# EAGLE design Register (EAGLE 7.3.0)
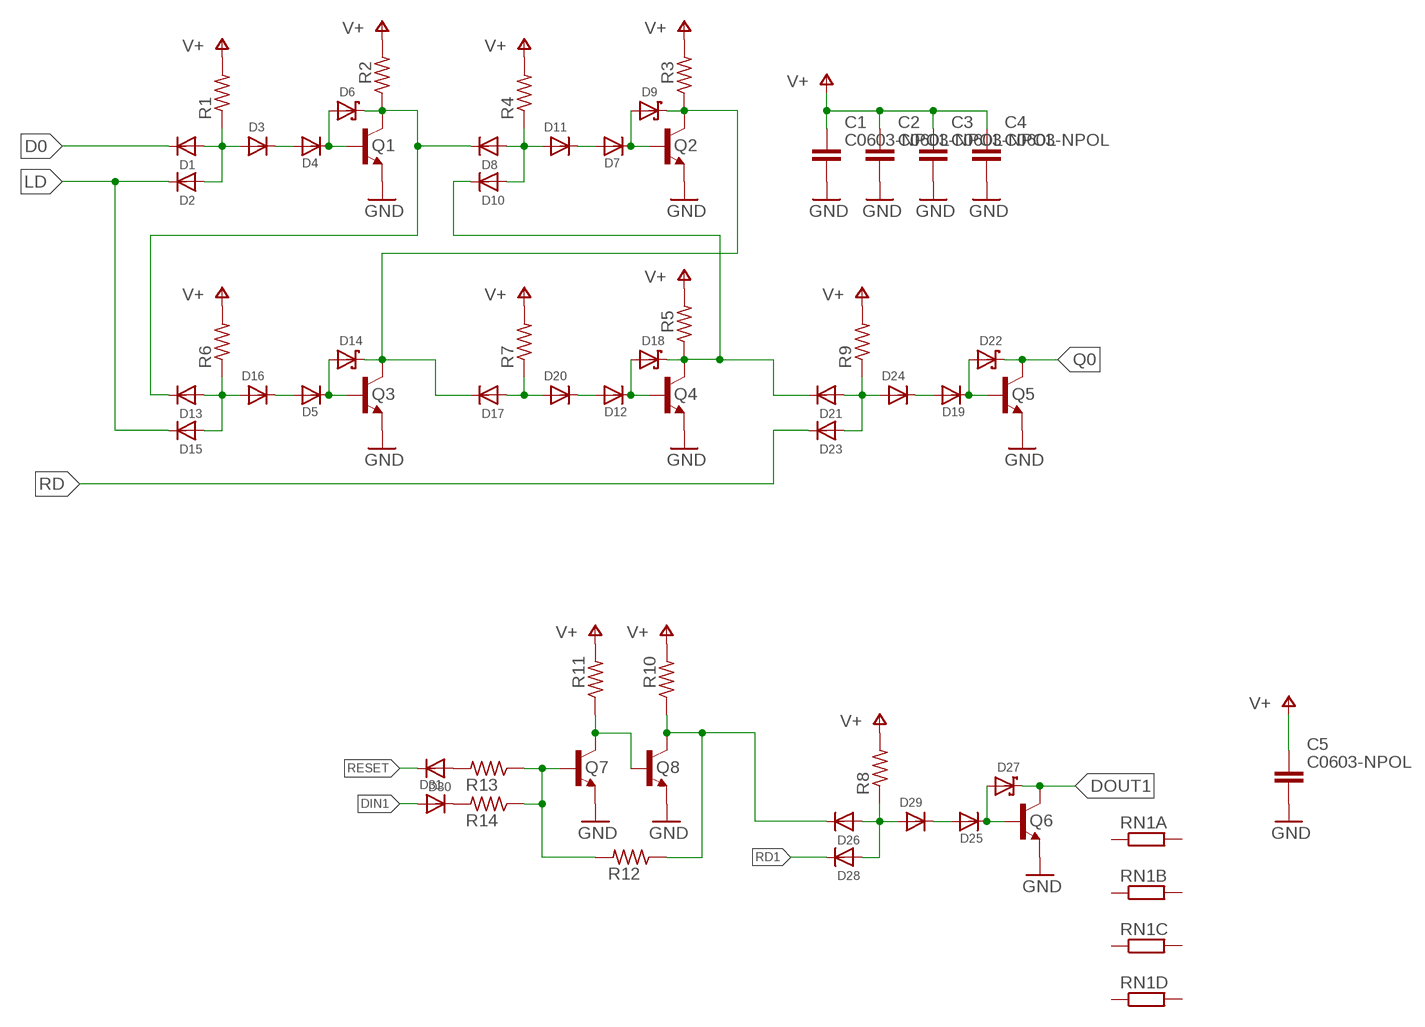
[diagram p0: schematic, sheet 1]

## Parts
C1  C0603-NPOL  [C0603]
C2  C0603-NPOL  [C0603]
C3  C0603-NPOL  [C0603]
C4  C0603-NPOL  [C0603]
C5  C0603-NPOL  [C0603]
D1  DIODE-SOD323  [SOD323F]
D2  DIODE-SOD323  [SOD323F]
D3  DIODE-SOD323  [SOD323F]
D4  DIODE-SOD323  [SOD323F]
D5  DIODE-SOD323  [SOD323F]
D6  SCHOTTKYSOT323  [SOT23]
D7  DIODE-SOD323  [SOD323F]
D8  DIODE-SOD323  [SOD323F]
D9  SCHOTTKYSOT323  [SOT23]
D10  DIODE-SOD323  [SOD323F]
D11  DIODE-SOD323  [SOD323F]
D12  DIODE-SOD323  [SOD323F]
D13  DIODE-SOD323  [SOD323F]
D14  SCHOTTKYSOT323  [SOT23]
D15  DIODE-SOD323  [SOD323F]
D16  DIODE-SOD323  [SOD323F]
D17  DIODE-SOD323  [SOD323F]
D18  SCHOTTKYSOT323  [SOT23]
D19  DIODE-SOD323  [SOD323F]
D20  DIODE-SOD323  [SOD323F]
D21  DIODE-SOD323  [SOD323F]
D22  SCHOTTKYSOT323  [SOT23]
D23  DIODE-SOD323  [SOD323F]
D24  DIODE-SOD323  [SOD323F]
D25  DIODE-SOD323  [SOD323F]
D26  DIODE-SOD323  [SOD323F]
D27  SCHOTTKYSOT323  [SOT23]
D28  DIODE-SOD323  [SOD323F]
D29  DIODE-SOD323  [SOD323F]
D30  DIODE-SOD323  [SOD323F]
D31  DIODE-SOD323  [SOD323F]
Q1  BC547-SOT23  [SOT23]
Q2  BC547-SOT23  [SOT23]
Q3  BC547-SOT23  [SOT23]
Q4  BC547-SOT23  [SOT23]
Q5  BC547-SOT23  [SOT23]
Q6  BC547-SOT23  [SOT23]
Q7  BC547-SOT23  [SOT23]
Q8  BC547-SOT23  [SOT23]
R1  470  R-0805  [R0805]
R2  150  R-0805  [R0805]
R3  150  R-0805  [R0805]
R4  470  R-0805  [R0805]
R5  150  R-0805  [R0805]
R6  470  R-0805  [R0805]
R7  470  R-0805  [R0805]
R8  470  R-0805  [R0805]
R9  470  R-0805  [R0805]
R10  150  R-0805  [R0805]
R11  150  R-0805  [R0805]
R12  150  R-0805  [R0805]
R13  150  R-0805  [R0805]
R14  150  R-0805  [R0805]
RN1  RESISTOR_ARRAY_4  [RN8P-4R-CRA06S]

## Nets
D0: D1.C
DIN1: D31.A
DOUT1: D27.3(C) Q6.3(C)
GND: C1.2 C2.2 C3.2 C4.2 C5.2 Q1.2(E) Q2.2(E) Q3.2(E) Q4.2(E) Q5.2(E) Q6.2(E) Q7.2(E) Q8.2(E)
LD: D2.C D15.C
N$1: D1.A D2.A D3.A R1.1
N$2: D3.C D4.A
N$3: D4.C D6.1(A) Q1.1(B)
N$4: D13.A D15.A D16.A R6.1
N$5: D8.A D10.A D11.A R4.1
N$6: D5.A D16.C
N$7: D7.A D11.C
N$8: D5.C D14.1(A) Q3.1(B)
N$9: D7.C D9.1(A) Q2.1(B)
N$10: D17.A D20.A R7.1
N$11: D12.A D20.C
N$12: D12.C D18.1(A) Q4.1(B)
N$13: D21.A D23.A D24.A R9.1
N$14: D19.A D24.C
N$15: D19.C D22.1(A) Q5.1(B)
N$16: D26.C Q8.3(C) R10.1 R12.1
N$17: D26.A D28.A D29.A R8.1
N$18: D25.A D29.C
N$19: D25.C D27.1(A) Q6.1(B)
N$20: Q7.3(C) Q8.1(B) R11.1
N$23: Q7.1(B) R12.2 R13.1 R14.1
N$25: D30.A R13.2
N$26: D31.C R14.2
N$77: D10.C D18.3(C) D21.C Q4.3(C) R5.1
N$88: D9.3(C) D14.3(C) D17.C Q2.3(C) Q3.3(C) R3.1
N$99: D6.3(C) D8.C D13.C Q1.3(C) R2.1
Q0: D22.3(C) Q5.3(C)
RD: D23.C
RD1: D28.C
RESET: D30.C
V+: C1.1 C2.1 C3.1 C4.1 C5.1 R1.2 R2.2 R3.2 R4.2 R5.2 R6.2 R7.2 R8.2 R9.2 R10.2 R11.2
Unconnected: RN1.1 RN1.2 RN1.3 RN1.4 RN1.5 RN1.6 RN1.7 RN1.8

## Library data of the parts
C1-C5 = SmallRoomLabs_Discrete:C0603
D1-D5 D7 D8 D10-D13 D15-D17 D19-D21 D23-D26 D28-D31 = SmallRoomLabs_Semiconductor:DIODE
D6 D9 D14 D18 D22 D27 = SmallRoomLabs_Semiconductor:SCHOTTKY
Q1-Q8 = SmallRoomLabs_Semiconductor:BC547
R1-R14 = SmallRoomLabs_Discrete:R
RN1 = dp_devices:RESISTOR_ARRAY_4: 4 Resistor Array 0603

## Board
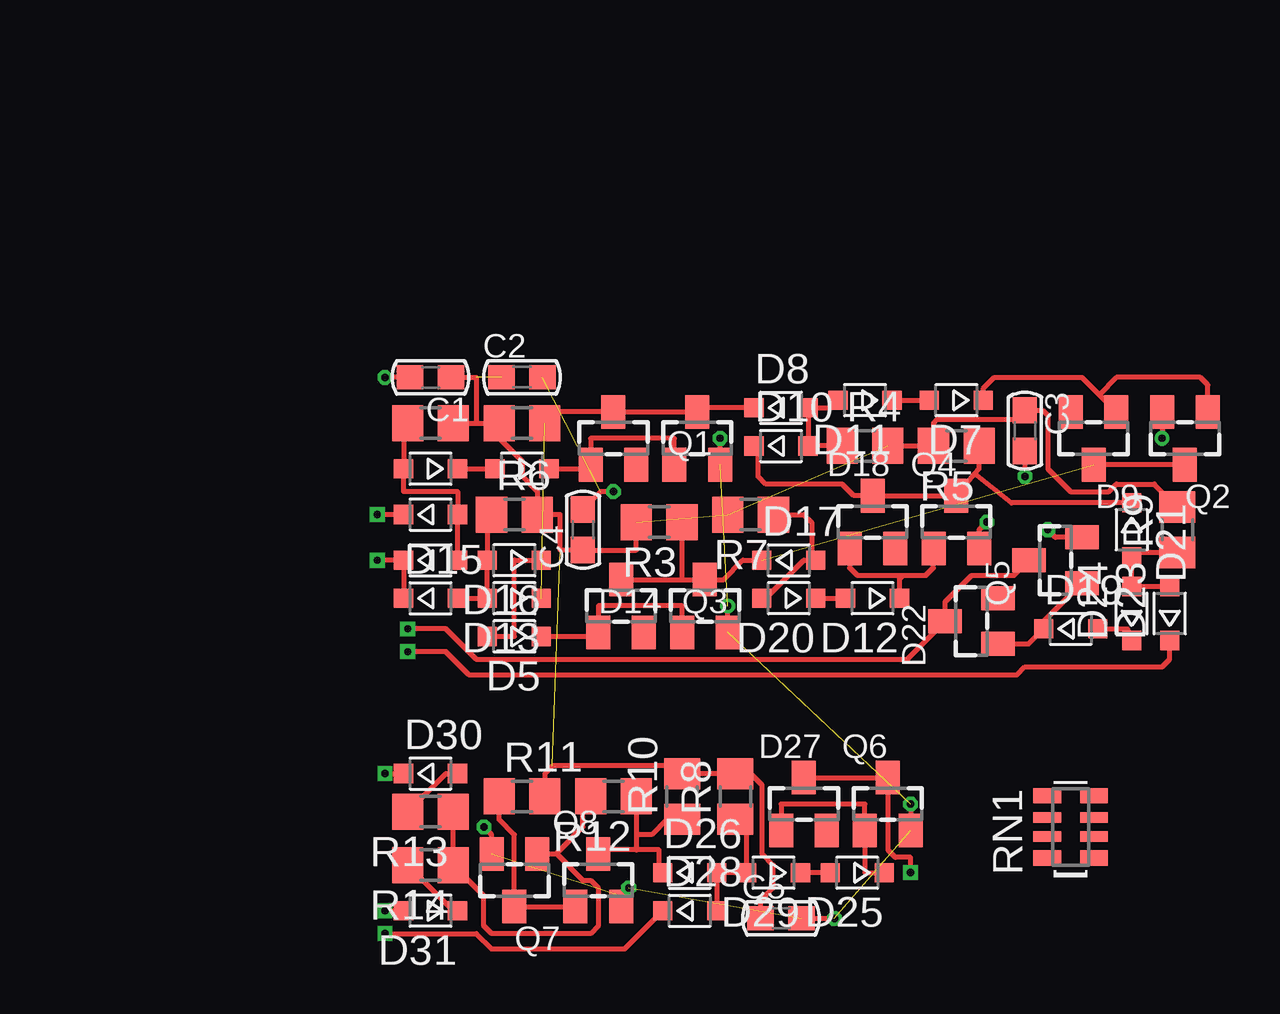
[diagram p1: board, top side]
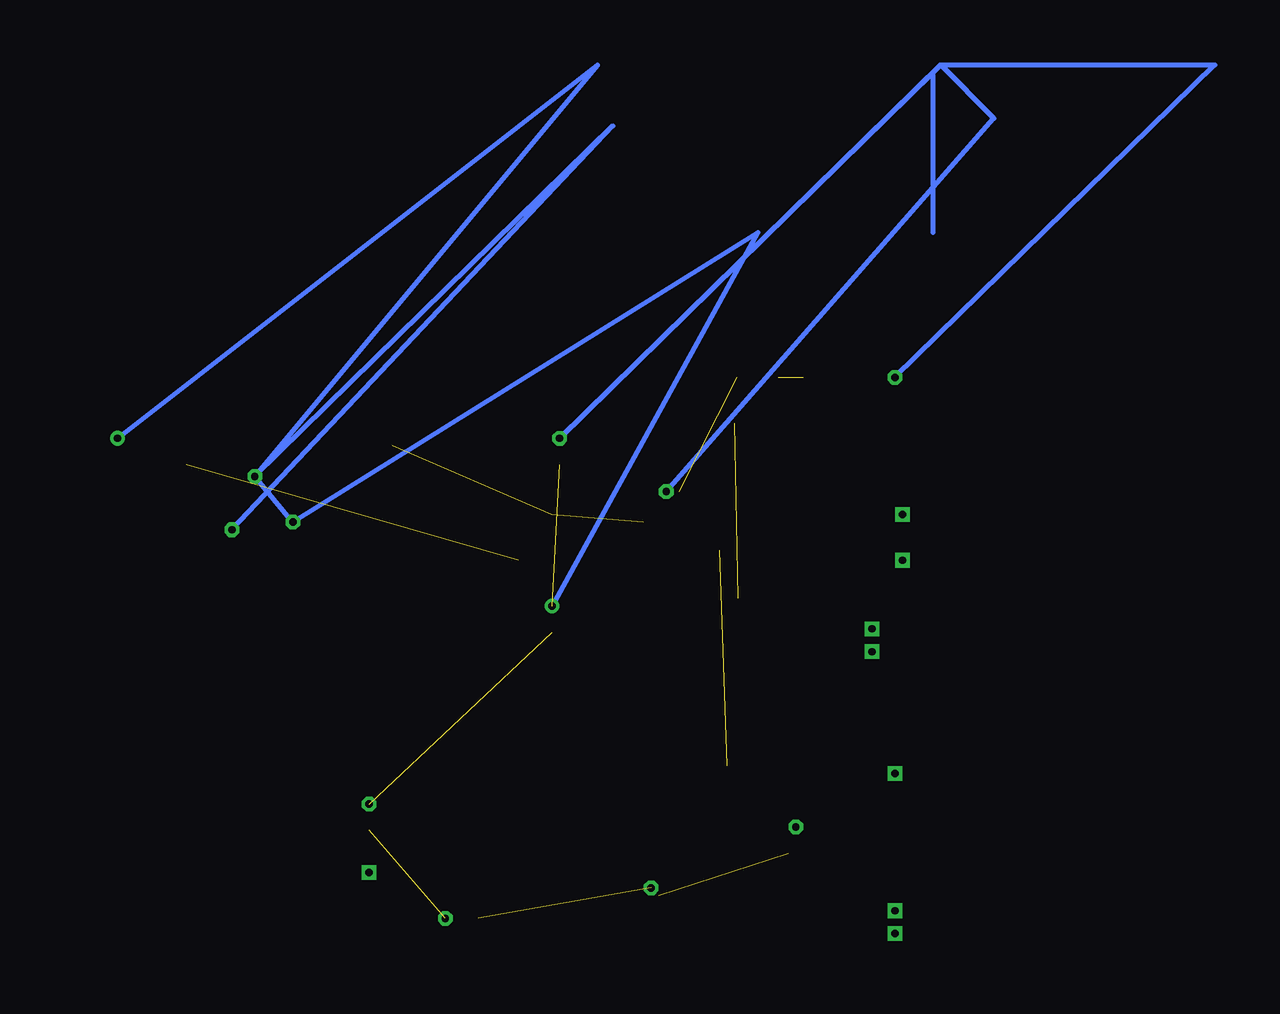
[diagram p2: board, bottom side, seen from below]

No outline drawn. Coordinates in mm, seen from the top.
Copper layers (1*16): Top 0.035mm / dielectric 1.5mm / Bottom 0.035mm
Design rules "dirt_cheap_dirty_boards.v1": minimum track width 5mil, minimum drill 12mil, track to track 5mil, track to pad 5mil, pad to pad 5mil, via to via 5mil, smd to smd 0mil, copper to edge 10mil, drill to drill 10mil, minimum pad ring 10mil, minimum via ring 6mil, stop-mask expansion 2mil, vias tented up to drill 25mil, thermal gap 10mil
tKeepout: area 2.2,157.5 to 92.1,180.3; area 104.8,157.8 to 194.6,180.7; area 104.8,131.4 to 194.6,154.3; area 104.8,106.4 to 194.6,129.2; area 105.1,81 to 194.9,103.8

### Footprints (pad centres in the part's own frame; a part is rotated, then mirrored left to right if it is on the bottom)
C0603 = smd 1.1 x 1: 1 -0.85,0; 2 0.85,0
SOD323F = smd 0.8 x 0.8: A 1.125,0; C -1.125,0
SOT23 = smd 1 x 1.4: 1 -0.95,-1.1; 2 0.95,-1.1; 3 0,1.1
R0805 = smd 1.3 x 1.5: 1 -0.95,0; 2 0.95,0
RN8P-4R-CRA06S = smd 0.63 x 1.15: 1 -1.295,-0.975; 4 1.295,-0.975; 5 1.295,0.975; 8 -1.295,0.975 | smd 0.44 x 1.15: 2 -0.4,-0.975; 3 0.4,-0.975; 6 0.4,0.975; 7 -0.4,0.975

### Placement (x,y rotation side)
C1  26.04,70.17 180 top
C2  29.84,70.17 0 top
C3  50.8,67.94 270 top
C4  32.38,63.82 90 top
C5  40.64,47.62 0 top
D1  26.04,64.45 0 top
D2  26.04,62.55 0 top
D3  26.04,66.36 180 top
D4  29.84,66.36 180 top
D5  29.53,59.37 180 top
D6  33.66,67.63 0 top
D7  47.94,69.22 180 top
D8  40.64,68.9 0 top
D9  53.66,67.63 180 top
D10  40.64,67.31 0 top
D11  44.13,69.22 180 top
D12  44.45,60.96 180 top
D13  29.53,60.96 180 top
D14  33.97,60.64 0 top
D15  26.04,60.96 0 top
D16  29.53,62.55 180 top
D17  40.96,62.55 0 top
D18  44.45,64.14 0 top
D19  52.7,59.69 0 top
D20  40.96,60.96 180 top
D21  55.24,63.82 270 top
D22  48.58,60.01 90 top
D23  56.83,60.33 90 top
D24  55.24,60.33 90 top
D25  43.81,49.53 180 top
D26  36.83,49.53 0 top
D27  41.59,52.39 0 top
D28  36.83,47.94 0 top
D29  40.32,49.53 180 top
D30  26.04,53.66 0 top
D31  26.04,47.94 180 top
Q1  37.15,67.63 0 top
Q2  57.47,67.63 180 top
Q3  37.47,60.64 0 top
Q4  47.94,64.14 0 top
Q5  52.07,62.55 90 top
Q6  45.09,52.39 0 top
Q7  29.53,49.21 180 top
Q8  33.02,49.21 0 top
R1  26.04,68.26 0 top
R2  29.84,68.26 180 top
R3  35.56,64.14 180 top
R4  44.13,67.31 0 top
R5  47.94,67.31 180 top
R6  29.53,64.45 0 top
R7  39.37,64.45 180 top
R8  38.73,52.7 90 top
R9  57.15,63.82 90 top
R10  36.51,52.7 90 top
R11  29.84,52.7 0 top
R12  33.66,52.7 180 top
R13  26.04,52.07 180 top
R14  26.04,49.85 180 top
RN1  52.7,51.44 90 top

### Tracks (layer width: path | path; a pad name or v marks a point on that pad's centre or on a via)
D0  (via drill 0.3)
  Top 0.203: D1.C v23.81,64.45
DIN1  (via drill 0.3)
  Top 0.203: v24.13,47.94 D31.A
DOUT1  (via drill 0.3)
  Top 0.203: D27.3 Q6.3 45.09,50.48 45.4,50.16 46.04,50.16 v46.04,49.53
GND  (via drill 0.3)  (6 unrouted)
  Top 0.203: v33.66,65.41 33.12,65.41 C4.2 | C1.2 v24.13,70.17 | Q3.2 v38.41,60.64 v38.42,60.64 | Q1.2 v38.1,67.62 v38.1,67.63 | Q4.2 48.89,63.81 v49.21,64.14 | C3.2 v50.8,66.04 | Q5.2 52.07,63.5 v51.75,63.82 | Q2.2 v56.52,67.63 | Q7.2 28.58,51.12 v28.26,51.44 | Q8.2 33.97,48.58 v34.29,48.9 | v46.04,52.39 Q6.2 | C5.2 v42.86,47.62
  Bottom 0.203: v33.66,65.41 20,80.96 22.22,83.18 | 22.22,83.18 v38.1,67.63 22.54,82.87 22.54,76.2 | 22.22,83.18 10.8,83.18 v24.13,70.17 | v38.41,60.64 29.84,76.2 v49.21,64.14 v50.8,66.04 | v51.75,63.82 35.88,80.64 v50.8,66.04 | v56.52,67.63 36.52,83.19 v50.8,66.04
LD  (via drill 0.3)
  Top 0.203: D15.C D2.C v23.81,62.55
N$1
  Top 0.203: R1.1 24.91,68.26 D3.A 24.91,65.41 27.16,65.41 D1.A D2.A
N$2
  Top 0.203: D3.C D4.A
N$3
  Top 0.203: Q1.1 36.2,67.63 32.7,67.63 D6.1 32.7,66.36 D4.C
N$4
  Top 0.203: D15.A D13.A D16.A 28.4,64.45 R6.1
N$5
  Top 0.203: R4.1 D10.A D8.A 42.69,68.9 D11.A
N$6
  Top 0.203: D5.A 29.53,59.37 29.53,62.55 D16.C
N$7
  Top 0.203: D11.C D7.A
N$8
  Top 0.203: Q3.1 36.51,60.64 33.02,60.64 D14.1 33.02,59.37 D5.C
N$9
  Top 0.203: D7.C 49.07,69.7 49.53,70.17 53.17,70.17 53.89,69.45 | 53.89,69.45 D9.1 | Q2.1 58.42,69.85 58.1,70.17 54.61,70.17 53.89,69.45
N$10
  Top 0.203: D20.A 40.01,60.96 41.59,62.55 D17.A 41.91,62.72 41.91,64.14 41.59,64.45 R7.1
N$11
  Top 0.203: D20.C D12.A
N$12
  Top 0.203: D18.1 43.5,62.23 43.81,61.91 45.72,61.91 | 45.72,61.91 46.67,61.91 46.99,62.23 Q4.1 | D12.C 45.58,61.77 45.72,61.91
N$13
  Top 0.203: D23.A D24.A D21.A 55.1,62.87 R9.1
N$14
  Top 0.203: D19.A 55.07,59.69 D24.C
N$15
  Top 0.203: D22.1 50.95,59.06 D19.C 51.58,60.01 Q5.1
N$16
  Top 0.203: D26.C 35.56,49.53 35.56,50.48 34.61,50.48 | 34.61,50.48 33.02,50.48 Q8.3 | R12.1 34.6,51.12 | 34.6,51.12 34.6,50.48 34.61,50.48 | R10.1 35.88,51.76 35.24,51.12 34.6,51.12
N$17
  Top 0.203: R8.1 39.2,51.44 D29.A D26.A D28.A
N$18
  Top 0.203: D25.A D29.C
N$19
  Top 0.203: Q6.1 44.13,52.39 40.64,52.39 | 40.64,52.39 | 40.64,52.39 D27.1 | Q6.1 | Q6.1 44.13,49.53 D25.C
N$20
  Top 0.203: Q8.1 Q7.3 29.53,51.12 28.89,51.75 R11.1
N$23
  Top 0.203: R12.2 32.38,52.38 32.38,51.44 31.26,50.31 Q7.1 31.29,50.31 32.38,49.21 32.7,49.21 33.02,48.9 33.02,47.31 32.7,46.99 28.57,46.99 28.26,47.31 28.26,48.58 R14.1 R13.1
N$25
  Top 0.203: R13.2 26.67,53.66 D30.A
N$26
  Top 0.203: D31.C 26.99,47.94 R14.2
N$77
  Top 0.203: D10.C 39.69,67.14 39.69,66.04 40.01,65.72 43.18,65.72 43.67,65.23 D18.3 Q4.3 48.72,66.14 | 48.72,66.14 48.9,66.36 R5.1 | D21.C 50.24,64.94 48.72,66.14
N$88  (1 unrouted)
  Top 0.203: D14.3 36.51,61.74 | 36.51,61.74 Q3.3 38.25,61.74 39.05,62.55 D17.C | R3.1 36.51,61.74 | Q2.3 D9.3
N$99  (1 unrouted)
  Top 0.203: R2.1 30.8,68.73 D6.3 Q1.3 37.32,68.9 D8.C
Q0  (via drill 0.3)
  Top 0.203: Q5.3 50.34,61.91 48.58,61.91 47.48,60.81 D22.3 45.89,58.42 27.94,58.42 26.67,59.69 v25.08,59.69
RD  (via drill 0.3)
  Top 0.203: D23.C 56.83,58.42 56.52,58.1 50.8,58.1 50.48,57.78 27.62,57.78 26.67,58.74 v25.08,58.74
RD1  (via drill 0.3)
  Top 0.203: v24.13,46.99 27.94,46.99 28.57,46.35 34.12,46.35 D28.C
RESET  (via drill 0.3)
  Top 0.203: v24.13,53.66 D30.C
V+  (4 unrouted)
  Top 0.203: R1.2 27.94,68.26 | 27.94,68.26 R2.2 28.89,67.62 29.84,66.67 29.84,66.04 30.48,65.41 R6.2 31.43,64.45 31.43,62.97 C4.1 34.61,62.97 R3.2 | C1.1 27.94,70.17 27.94,68.26 | R4.2 R5.2 46.99,68.27 47.15,68.42 50.43,68.42 C3.1 51.54,68.8 51.75,68.58 51.75,66.36 52.7,65.41 54.29,65.41 54.61,65.72 56.2,65.72 R9.2 | R11.2 30.8,53.66 31.11,53.98 35.88,53.98 36.2,53.66 R10.2 R8.2 39.37,53.66 39.85,53.18 39.85,50.32 40.32,49.85 40.32,48.9 39.79,48.36 C5.1